# Altium schematic sheet UI_mon.SchDoc: AMC FMC Carrier v4.0.5
size A4; CompanyName: WUT; Organization: WUT ISE; Address1: Warsaw University of Technology; Address2: Nowowiejska 15/19 00-665 Warsaw; Address3: t.przywozki@gmail.com; Revision: 1; SheetNumber: 16; SheetTotal: 29; Project: AMC FMC Carrier v4.0.5; ModifiedBy: F. Świtakowski; CreateDate: XX/XX/XXXX; CheckedDate: -; Title2: Power Measurement; DivGrp: ISE; Designer: T. Przywozki; ModifiedDate: -; ProjectName: ADC/DAC MEZZANINE
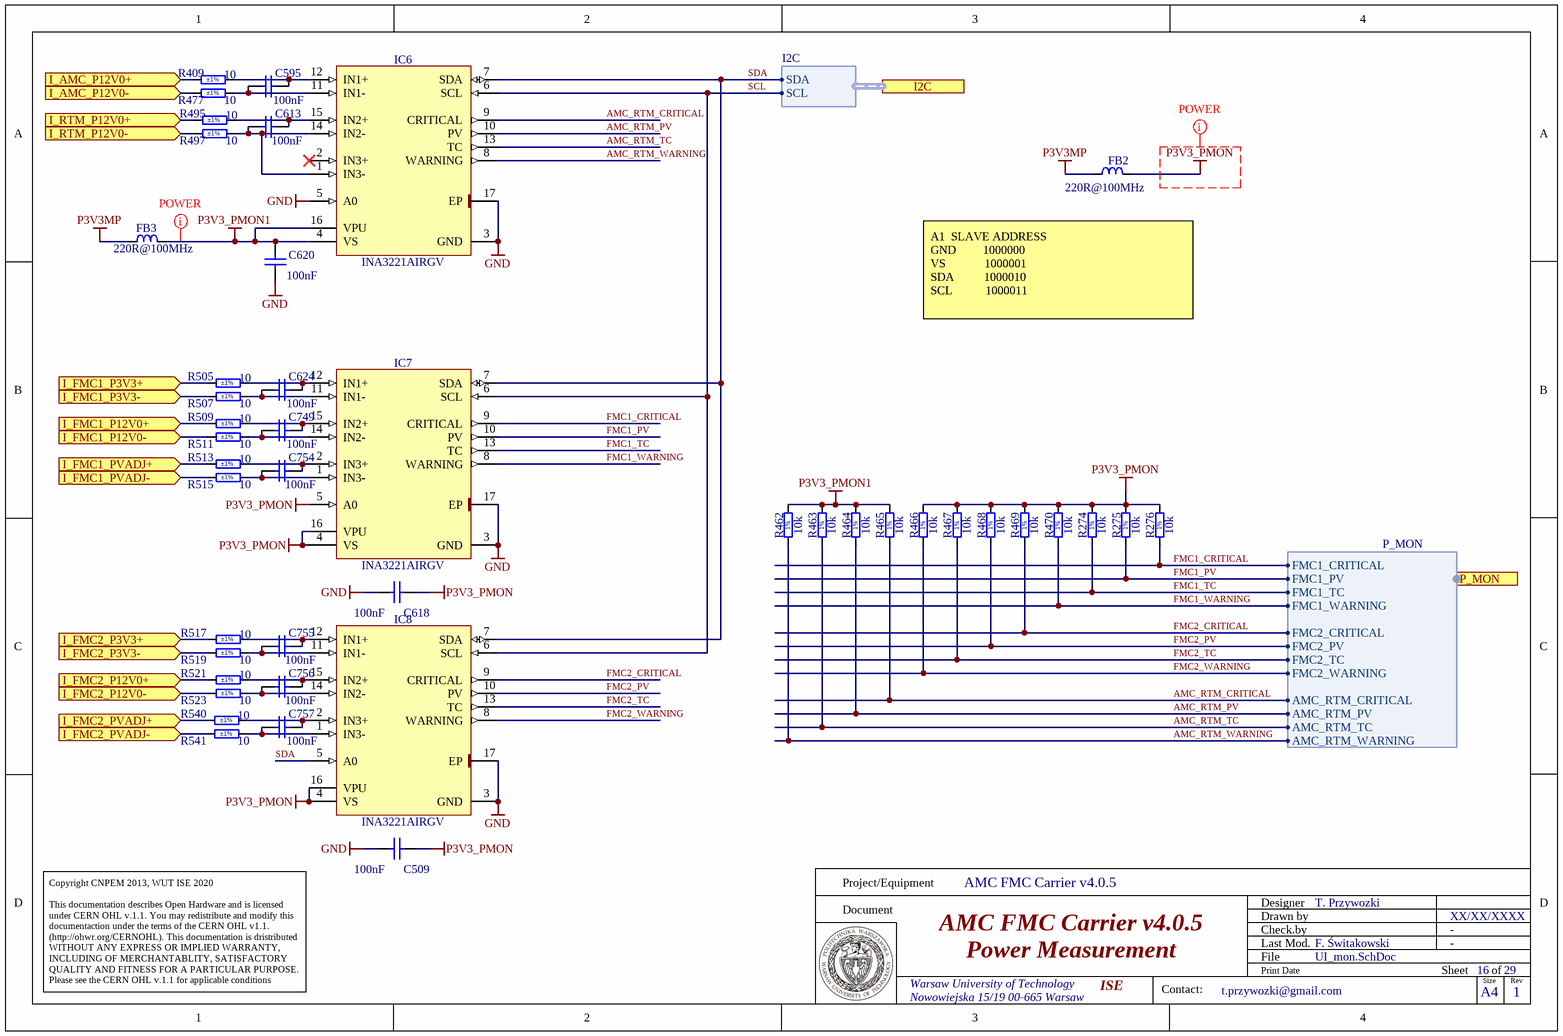
[diagram p0: UI_mon.SchDoc]

## Parts
C509  100nF  [CAPC0603X33N]
C595  100nF  [CAPC0603X33N]
C613  100nF  [CAPC0603X33N]
C618  100nF  [CAPC0603X33N]
C620  100nF  [CAPC0603X33N]
C624  100nF  [CAPC0603X33N]
C749  100nF  [CAPC0603X33N]
C754  100nF  [CAPC0603X33N]
C755  100nF  [CAPC0603X33N]
C756  100nF  [CAPC0603X33N]
C757  100nF  [CAPC0603X33N]
FB2  220R@100MHz  [INDC2012X105N]
FB3  220R@100MHz  [INDC2012X105N]
IC6  INA3221AIRGV  [QFN65P400X400X100-17N-S225]
IC7  INA3221AIRGV  [QFN65P400X400X100-17N-S225]
IC8  INA3221AIRGV  [QFN65P400X400X100-17N-S225]
R274  10k  [RESC1005X40N]
R275  10k  [RESC1005X40N]
R276  10k  [RESC1005X40N]
R409  10  Tolerance: ±1%  [RESC1005X40N]
R462  10k  [RESC1005X40N]
R463  10k  [RESC1005X40N]
R464  10k  [RESC1005X40N]
R465  10k  [RESC1005X40N]
R466  10k  [RESC1005X40N]
R467  10k  [RESC1005X40N]
R468  10k  [RESC1005X40N]
R469  10k  [RESC1005X40N]
R470  10k  [RESC1005X40N]
R477  10  Tolerance: ±1%  [RESC1005X40N]
R495  10  Tolerance: ±1%  [RESC1005X40N]
R497  10  Tolerance: ±1%  [RESC1005X40N]
R505  10  Tolerance: ±1%  [RESC1005X40N]
R507  10  Tolerance: ±1%  [RESC1005X40N]
R509  10  Tolerance: ±1%  [RESC1005X40N]
R511  10  Tolerance: ±1%  [RESC1005X40N]
R513  10  Tolerance: ±1%  [RESC1005X40N]
R515  10  Tolerance: ±1%  [RESC1005X40N]
R517  10  Tolerance: ±1%  [RESC1005X40N]
R519  10  Tolerance: ±1%  [RESC1005X40N]
R521  10  Tolerance: ±1%  [RESC1005X40N]
R523  10  Tolerance: ±1%  [RESC1005X40N]
R540  10  Tolerance: ±1%  [RESC1005X40N]
R541  10  Tolerance: ±1%  [RESC1005X40N]

## Ports
I2C (harness I2C), I_AMC_P12V0+ (in), I_AMC_P12V0- (in), I_FMC1_P3V3+ (in), I_FMC1_P3V3- (in), I_FMC1_P12V0+ (in), I_FMC1_P12V0- (in), I_FMC1_PVADJ+ (in), I_FMC1_PVADJ- (in), I_FMC2_P3V3+ (in), I_FMC2_P3V3- (in), I_FMC2_P12V0+ (in), I_FMC2_P12V0- (in), I_FMC2_PVADJ+ (in), I_FMC2_PVADJ- (in), I_RTM_P12V0+ (in), I_RTM_P12V0- (in), P_MON (harness P_MON)

## Harnesses
I2C: SCL, SDA
P_MON: FMC1_CRITICAL, FMC1_TC, FMC1_WARNING, AMC_RTM_CRITICAL, FMC2_WARNING, AMC_RTM_PV, FMC2_CRITICAL, AMC_RTM_TC, FMC2_PV, AMC_RTM_WARNING, FMC2_TC, FMC1_PV

## Nets
GND: C509.2 C618.2 C620.2 IC6.3(GND) IC6.5(A0) IC6.17(EP) IC7.3(GND) IC7.17(EP) IC8.3(GND) IC8.17(EP)
P3V3_PMON: C509.1 C618.1 FB2.2 IC7.4(VS) IC7.5(A0) IC7.16(VPU) IC8.4(VS) IC8.16(VPU) R274.2 R275.2 R276.2 R466.2 R467.2 R468.2 R469.2 R470.2
P3V3_PMON1: C620.1 FB3.2 IC6.4(VS) IC6.16(VPU) R462.2 R463.2 R464.2 R465.2
P3V3MP: FB2.1 FB3.1
AMC_RTM_CRITICAL: IC6.9(CRITICAL) R465.1 ; port P_MON.AMC_RTM_CRITICAL
AMC_RTM_PV: IC6.10(PV) R464.1 ; port P_MON.AMC_RTM_PV
AMC_RTM_TC: IC6.13(TC) R463.1 ; port P_MON.AMC_RTM_TC
AMC_RTM_WARNING: IC6.8(WARNING) R462.1 ; port P_MON.AMC_RTM_WARNING
FMC1_CRITICAL: IC7.9(CRITICAL) R276.1 ; port P_MON.FMC1_CRITICAL
FMC1_PV: IC7.10(PV) R275.1 ; port P_MON.FMC1_PV
FMC1_TC: IC7.13(TC) R274.1 ; port P_MON.FMC1_TC
FMC1_WARNING: IC7.8(WARNING) R470.1 ; port P_MON.FMC1_WARNING
FMC2_CRITICAL: IC8.9(CRITICAL) R469.1 ; port P_MON.FMC2_CRITICAL
FMC2_PV: IC8.10(PV) R468.1 ; port P_MON.FMC2_PV
FMC2_TC: IC8.13(TC) R467.1 ; port P_MON.FMC2_TC
FMC2_WARNING: IC8.8(WARNING) R466.1 ; port P_MON.FMC2_WARNING
I_AMC_P12V0+: R409.1 ; port I_AMC_P12V0+
I_AMC_P12V0-: R477.1 ; port I_AMC_P12V0-
I_FMC1_P3V3+: R505.1 ; port I_FMC1_P3V3+
I_FMC1_P3V3-: R507.1 ; port I_FMC1_P3V3-
I_FMC1_P12V0+: R509.1 ; port I_FMC1_P12V0+
I_FMC1_P12V0-: R511.1 ; port I_FMC1_P12V0-
I_FMC1_PVADJ+: R513.1 ; port I_FMC1_PVADJ+
I_FMC1_PVADJ-: R515.1 ; port I_FMC1_PVADJ-
I_FMC2_P3V3+: R517.1 ; port I_FMC2_P3V3+
I_FMC2_P3V3-: R519.1 ; port I_FMC2_P3V3-
I_FMC2_P12V0+: R521.1 ; port I_FMC2_P12V0+
I_FMC2_P12V0-: R523.1 ; port I_FMC2_P12V0-
I_FMC2_PVADJ+: R540.1 ; port I_FMC2_PVADJ+
I_FMC2_PVADJ-: R541.1 ; port I_FMC2_PVADJ-
I_RTM_P12V0+: R495.1 ; port I_RTM_P12V0+
I_RTM_P12V0-: R497.1 ; port I_RTM_P12V0-
SCL: IC6.6(SCL) IC7.6(SCL) IC8.6(SCL) ; port I2C.SCL
SDA: IC6.7(SDA) IC7.7(SDA) IC8.5(A0) IC8.7(SDA) ; port I2C.SDA
NetC595_1: C595.1 IC6.11(IN1-) R477.2
NetC595_2: C595.2 IC6.12(IN1+) R409.2
NetC613_1: C613.1 IC6.1(IN3-) IC6.14(IN2-) R497.2
NetC613_2: C613.2 IC6.15(IN2+) R495.2
NetC624_1: C624.1 IC7.11(IN1-) R507.2
NetC624_2: C624.2 IC7.12(IN1+) R505.2
NetC749_1: C749.1 IC7.14(IN2-) R511.2
NetC749_2: C749.2 IC7.15(IN2+) R509.2
NetC754_1: C754.1 IC7.1(IN3-) R515.2
NetC754_2: C754.2 IC7.2(IN3+) R513.2
NetC755_1: C755.1 IC8.11(IN1-) R519.2
NetC755_2: C755.2 IC8.12(IN1+) R517.2
NetC756_1: C756.1 IC8.14(IN2-) R523.2
NetC756_2: C756.2 IC8.15(IN2+) R521.2
NetC757_1: C757.1 IC8.1(IN3-) R541.2
NetC757_2: C757.2 IC8.2(IN3+) R540.2

Not connected (* = marked no-connect by the designer): IC6 2(IN3+)*

## Layout directives
net class POWER: P3V3_PMON, P3V3_PMON1

## Notes on the sheet
- (near FB2) A1 	SLAVE ADDRESS
  GND         1000000
  VS             1000001
  SDA          1000010
  SCL           1000011
- Project/Equipment
- Document
- Designer
- Drawn by
- Check.by
- Copyright CNPEM 2013, WUT ISE 2020
  This documentation describes Open Hardware and is licensed under CERN OHL v.1.1. You may redistribute and modify this documentaction under the terms of the CERN OHL v1.1.
  (http://ohwr.org/CERNOHL). This documentation is dristributed WITHOUT ANY EXPRESS OR IMPLIED WARRANTY, INCLUDING OF MERCHANTABLITY, SATISFACTORY QUALITY AND FITNESS FOR A PARTICULAR PURPOSE. Please see the CERN OHL v.1.1 for applicable conditions
- File
- Last Mod.
- Print Date
- Sheet
- Size
- A4
- of
- Rev
- Contact:
- (in symbol R0402_10K_1%_0.0625W_100PPM) 1%

## Library data of the parts
C509 C618 C620 = CC0201_100NF_6.3V_10%_X5R: Non-polarised capacitor; Part Description: SMD Multilayer Chip Ceramic Capacitor; Manufacturer: GENERIC; Manufacturer1 Part Number: 02016D104KAT2A; Voltage: 6.3V; TC: X5R; Tolerance: ±10%; Table: Capacitors SMD; Part Number: CC0201_100NF_6.3V_10%_X5R; Component Kind: Standard; Component Type: Standard; Pin Count: 2; Value: 100nF; Status: Not Recommended; Manufacturer Part Number: CC0201_100NF_6.3V_10%_X5R; Case: 0201; Mounted: Yes; Socket: No; SMD: Yes; Manufacturer1 Example: AVX; Manufacturer1 ComponentHeight: 0.33mm; HelpURL: \\cern.ch\dfs\Applications\Altium\Datasheets\CC0201_X5R_AVX.pdf; Author: CERN DEM JLC; CreateDate: 2007-12-03; LatestRevisionDate: 2007-12-03
C595 C613 C624 C749 C754-C757 = CC0201_100NF_6.3V_10%_X5R: Non-polarised capacitor; Part Description: SMD Multilayer Chip Ceramic Capacitor; Manufacturer: GENERIC; Manufacturer1 Part Number: 02016D104KAT2A; Voltage: 6.3V; TC: X5R; Tolerance: ±10%; Part Number: CC0201_100NF_6.3V_10%_X5R; Component Kind: Standard; Component Type: Standard; Pin Count: 2; Value: 100nF; Status: Not Recommended; Manufacturer Part Number: CC0201_100NF_6.3V_10%_X5R; Case: 0201; Mounted: Yes; Socket: No; SMD: Yes; Sense: No; Manufacturer1 Example: AVX; Manufacturer1 ComponentHeight: 0.33mm; HelpURL: \\cern.ch\dfs\Applications\Altium\Datasheets\CC0201_X5R_AVX.pdf; Author: CERN DEM JLC; CreateDate: 03.12.2007; LatestRevisionDate: 03.12.2007
FB2 FB3 = IND0805_MURATA_BLM21PG221SN1D: Inductor; Part Description: SMD EMIFIL Suppression Chip Bead Ferrite; Manufacturer: MURATA; Power: 2A; Resistance: 0.05R; Tolerance: ±25%; Table: Inductors SMD; Part Number: IND0805_MURATA_BLM21PG221SN1D; Component Kind: Standard; Component Type: Standard; Pin Count: 2; Value: 220R@100MHz; Status: None; Manufacturer Part Number: BLM21PG221SN1D; Case: 0805; Mounted: Yes; Socket: No; SMD: Yes; ComponentHeight: 1.05mm; HelpURL: \\cern.ch\dfs\Applications\Altium\Datasheets\IND0402_MURATA_BLM21P.pdf; Author: CERN DEM JLC; CreateDate: 25/01/2010; LatestRevisionDate: 25/01/2010
IC6-IC8 = INA3221AIRGV: Triple-Channel, High-Side Measurement, Shunt and Bus Voltage Monitor With I2C and SMBUS-Compatible Interface; Manufacturer: TEXAS INSTRUMENTS; PressFit: No; Bonding: No; Part Number: INA3221AIRGV; Component Kind: Standard; Component Type: Standard; Device: INA3221AIRGV; PackageDescription: QFN, 0.65mm Pitch, Square; 16 Pin, 4.00mm L X 4.00mm W X 1.00mm H body (w/Thermal Tab 2.25 X 2.25mm), IPC Medium Density; Part Description: Triple-Channel, High-Side Measurement, Shunt and Bus Voltage Monitor With I2C and SMBUS-Compatible Interface; Manufacturer Part Number: INA3221AIRGV; Pin Count: 17; Case: QFN16; Mounted: Yes; Socket: No; SMD: Yes; Sense: No; ComponentHeight: 1mm; Author: CERN DEM MR; HelpURL: \\cern.ch\dfs\Applications\Altium\Datasheets\INA3221AIRGV.pdf; CreateDate: 01.12.2016; LatestRevisionDate: 01.12.2016
R274-R276 R462-R470 = R0402_10K_1%_0.0625W_100PPM: Resistor - 1%; Manufacturer: GENERIC; Part Description: General Purpose Thick Film Chip Resistor; Manufacturer1 Part Number: 232270671003L; TC: ±100ppm/°C; PressFit: No; Manufacturer Part Number: R0402_10K_1%_0.0625W_100PPM; Part Number: R0402_10K_1%_0.0625W_100PPM; Tolerance: ±1%; Value: 10k; Component Kind: Standard; Component Type: Standard; Pin Count: 2; Status: Not Recommended; Power: 0.0625W; Case: 0402; Mounted: Yes; Sense: No; Socket: No; SMD: Yes; Manufacturer1 Example: YAGEO PHYCOMP; Manufacturer1 ComponentHeight: 0.4mm; HelpURL: \\cern.ch\dfs\Applications\Altium\Datasheets\R0402_Phycomp_RC0402.pdf; Author: CERN DEM JLC; CreateDate: 03.12.2007; LatestRevisionDate: 17.10.2012
R409 R477 R495 R497 R505 R507 R509 R511 R513 R515 R517 R519 R521 R523 R540 R541 = R0402_10R_1%_0.0625W_200PPM: Resistor - 1%; Part Description: General Purpose Thick Film Chip Resistor; Manufacturer: GENERIC; Manufacturer1 Part Number: 232270671009L; TC: ±200ppm/°C; PressFit: No; Part Number: R0402_10R_1%_0.0625W_200PPM; Component Kind: Standard; Component Type: Standard; Pin Count: 2; Value: 10; Status: Not Recommended; Power: 0.0625W; Manufacturer Part Number: R0402_10R_1%_0.0625W_200PPM; Case: 0402; Mounted: Yes; Sense: No; Socket: No; SMD: Yes; Manufacturer1 Example: YAGEO PHYCOMP; Manufacturer1 ComponentHeight: 0.4mm; HelpURL: \\cern.ch\dfs\Applications\Altium\Datasheets\R0402_Phycomp_RC0402.pdf; Author: CERN DEM JLC; CreateDate: 24.06.2009; LatestRevisionDate: 17.10.2012